# EAGLE design Motherboard (EAGLE 9.4.2)
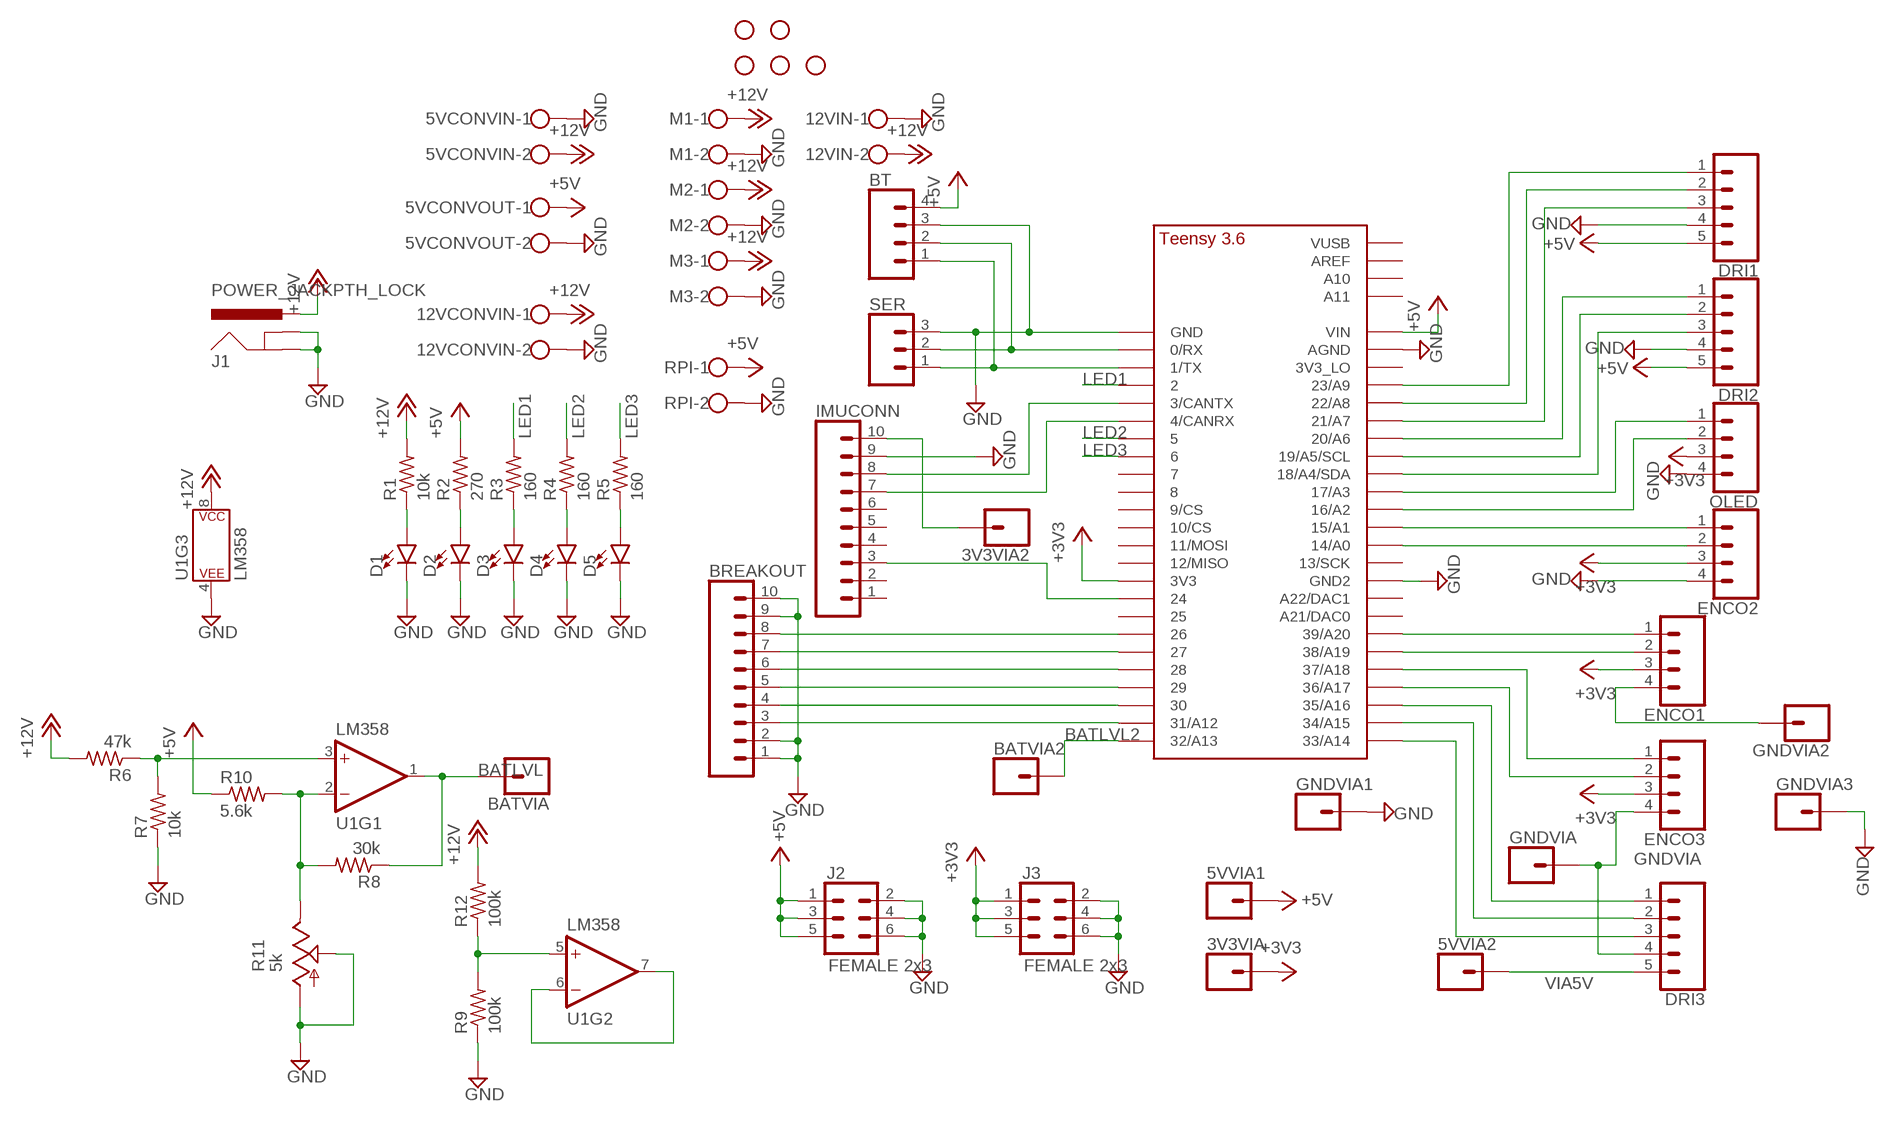
[diagram p0: schematic, sheet 1]

## Parts
3V3VIA  CONN_01  [1X01]
3V3VIA2  CONN_01  [1X01]
5VCONVIN  W237-102  [W237-102]
5VCONVOUT  W237-102  [W237-102]
5VVIA1  CONN_01  [1X01]
5VVIA2  CONN_01  [1X01]
12VCONVIN  W237-102  [W237-102]
12VIN  W237-102  [W237-102]
BATVIA  CONN_01  [1X01]
BATVIA2  CONN_01  [1X01]
BREAKOUT  CONN_10LOCK  [1X10_LOCK]
BT  CONN_04LOCK  [1X04_LOCK]
D1  LED5MM-KIT  [LED_5MM-KIT]
D2  LED5MM-KIT  [LED_5MM-KIT]
D3  LED5MM-KIT  [LED_5MM-KIT]
D4  LED5MM-KIT  [LED_5MM-KIT]
D5  LED5MM-KIT  [LED_5MM-KIT]
DRI1  CONN_05LOCK  [1X05_LOCK]
DRI2  CONN_05LOCK  [1X05_LOCK]
DRI3  CONN_05LOCK  [1X05_LOCK]
ENCO1  CONN_04LOCK  [1X04_LOCK]
ENCO2  CONN_04LOCK  [1X04_LOCK]
ENCO3  CONN_04LOCK  [1X04_LOCK]
GNDVIA  CONN_01  [1X01]
GNDVIA1  CONN_01  [1X01]
GNDVIA2  CONN_01  [1X01]
GNDVIA3  CONN_01  [1X01]
H1  STAND-OFF  [STAND-OFF]
H2  STAND-OFF  [STAND-OFF]
H4  STAND-OFF  [STAND-OFF]
H5  STAND-OFF  [STAND-OFF]
H6  STAND-OFF  [STAND-OFF]
IMUCONN  CONN_10LOCK  [1X10_LOCK]
J1  POWER_JACKPTH_LOCK  [POWER_JACK_PTH_LOCK]
J2  FEMALE 2x3  CONN_03X2FEMALE  [2X3]
J3  FEMALE 2x3  CONN_03X2FEMALE  [2X3]
M1  W237-102  [W237-102]
M2  W237-102  [W237-102]
M3  W237-102  [W237-102]
OLED  CONN_04LOCK  [1X04_LOCK]
R1  10k  R-US_0207/10  [0207/10]
R2  270  R-US_0207/10  [0207/10]
R3  160  R-US_0207/10  [0207/10]
R4  160  R-US_0207/10  [0207/10]
R5  160  R-US_0207/10  [0207/10]
R6  47k  R-US_0207/10  [0207/10]
R7  10k  R-US_0207/10  [0207/10]
R8  30k  R-US_0207/10  [0207/10]
R9  100k  R-US_0207/10  [0207/10]
R10  5.6k  R-US_0207/10  [0207/10]
R11  5k  TRIM_US-B25P  [B25P]
R12  100k  R-US_0207/10  [0207/10]
RPI  W237-102  [W237-102]
SER  CONN_03LOCK  [1X03_LOCK]
U1  LM358  [DIP08]
U$1  TEENSY_3.5/3.6_BASIC  [TEENSY_3.5/3.6_BASIC]

## Nets
+3V3: 3V3VIA.1 ENCO1.3 ENCO2.3 ENCO3.3 J3.1 J3.3 J3.5 OLED.3 U$1.3V3
+5V: 5VCONVOUT.1 5VVIA1.1 BT.4 DRI1.5 DRI2.5 J2.1 J2.3 J2.5 R2.2 R10.1 RPI.1 U$1.VIN
+12V: 5VCONVIN.2 12VCONVIN.1 12VIN.2 J1.PWR M1.1 M2.1 M3.1 R1.2 R6.2 R12.2 U1.8(P$V+)
BATLVL: BATVIA.1 R8.1 U1.1(OUT)
BATLVL2: BATVIA2.1 U$1.32/A13
GND: 5VCONVIN.1 5VCONVOUT.2 12VCONVIN.2 12VIN.1 BREAKOUT.1 BREAKOUT.2 BREAKOUT.9 BREAKOUT.10 BT.3 D1.K(C) D2.K(C) D3.K(C) D4.K(C) D5.K(C) DRI1.4 DRI2.4 ENCO2.4 GNDVIA1.1 GNDVIA3.1 IMUCONN.9 J1.GND J1.GNDBREAK J2.2 J2.4 J2.6 J3.2 J3.4 J3.6 M1.2 M2.2 M3.2 OLED.4 R7.1 R9.1 R11.A R11.S RPI.2 SER.3 U1.4(P$V-) U$1.AGND U$1.GND U$1.GND2
GNDVIA: DRI3.4 ENCO3.4 GNDVIA.1
LED1: R3.2 U$1.2
LED2: R4.2 U$1.5
LED3: R5.2 U$1.6
N$1: DRI1.1 U$1.23/A9
N$2: DRI1.2 U$1.22/A8
N$3: DRI1.3 U$1.21/A7
N$4: DRI2.3 U$1.18/A4/SDA
N$5: DRI2.2 U$1.19/A5/SCL
N$6: DRI2.1 U$1.20/A6
N$7: ENCO2.1 U$1.15/A1
N$8: ENCO2.2 U$1.14/A0
N$9: ENCO1.1 U$1.39/A20
N$10: ENCO1.2 U$1.38/A19
N$11: ENCO3.1 U$1.37/A18
N$12: ENCO3.2 U$1.36/A17
N$13: DRI3.1 U$1.35/A16
N$14: DRI3.2 U$1.34/A15
N$15: DRI3.3 U$1.33/A14
N$16: BT.1 SER.1 U$1.1/TX
N$17: BT.2 SER.2 U$1.0/RX
N$18: IMUCONN.8 U$1.3/CANTX
N$19: IMUCONN.7 U$1.4/CANRX
N$20: IMUCONN.3 U$1.24
N$21: R9.2 R12.1 U1.5(+IN)
N$22: BREAKOUT.3 U$1.31/A12
N$23: BREAKOUT.4 U$1.30
N$24: BREAKOUT.5 U$1.29
N$25: BREAKOUT.6 U$1.28
N$26: BREAKOUT.7 U$1.27
N$27: BREAKOUT.8 U$1.26
N$28: D2.A R2.1
N$29: D1.A R1.1
N$30: D3.A R3.1
N$31: D5.A R5.1
N$32: D4.A R4.1
N$33: 3V3VIA2.1 IMUCONN.10
N$34: OLED.1 U$1.17/A3
N$35: OLED.2 U$1.16/A2
N$36: R6.1 R7.2 U1.3(+IN)
N$37: U1.6(-IN) U1.7(OUT)
N$38: R8.2 R10.2 R11.E U1.2(-IN)
N$39: ENCO1.4 GNDVIA2.1
VIA5V: 5VVIA2.1 DRI3.5
Unconnected: IMUCONN.1 IMUCONN.2 IMUCONN.4 IMUCONN.5 IMUCONN.6 U$1.3V3_LO U$1.7 U$1.8 U$1.9/CS U$1.10/CS U$1.11/MOSI U$1.12/MISO U$1.13/SCK U$1.21/DAC0(A21/DAC0) U$1.25 U$1.A10 U$1.A11 U$1.A22/DAC1 U$1.AREF U$1.VUSB

## Library data of the parts
3V3VIA 3V3VIA2 5VVIA1 5VVIA2 BATVIA BATVIA2 GNDVIA GNDVIA1-GNDVIA3 = SparkFun-Connectors:CONN_01: Single connection point. Often used as Generic Header-pin footprint for 0.1 inch spaced/style header connections On any of the 0.1 inch spaced packages, you can populate with these: Break Away Headers - Straight <https://www.sparkfun.com/products/116> (PRT-00116) Break Away Male Headers - Right Angle <https://www.sparkfun.com/products/553> (PRT-00553) Female Headers <https://www.sparkfun.com/products/115> (PRT-00115) Break Away Headers - Machine Pin <https://www.sparkfun.com/products/117> (PRT-00117) Break Away Female Headers - Swiss Machine Pin <https://www.sparkfun.com/products/743> (PRT-00743) This device is also useful as a general connection point to wire up your design to another part of your project. Our various solder wires solder well into these plated through hole pads. Hook-Up Wire - Assortment (Stranded, 22 AWG) <https://www.sparkfun.com/products/11375> (PRT-11375) Hook-Up Wire - Assortment (Solid Core, 22 AWG) <https://www.sparkfun.com/products/11367> (PRT-11367) View the entire wire category on our website here <https://www.sparkfun.com/categories/141> Special notes: SMTSO-256-ET is a "flush mount" nut for a 4-40 screw. We mostly use this on specialty testbeds; it is a nice way to connect hardware to your PCB at an adjustable hieght. Also note, the SNAP packages are for using a snappable style connector. We sell a baggie of snaps and they are also used on two LilyPad designs: Snap Assortment - 30 pack (male and female) <https://www.sparkfun.com/products/11347> (DEV-11347) LilyPad Arduino SimpleSnap <https://www.sparkfun.com/products/10941> (DEV-10941) LilyPad SimpleSnap Protoboard <https://www.sparkfun.com/products/10940> (DEV-10940)
5VCONVIN 5VCONVOUT 12VCONVIN 12VIN M1-M3 RPI = con-wago-500:W237-102: WAGO SCREW CLAMP; MPN: 237-102; OC_FARNELL: unknown; OC_NEWARK: 70K9898
BREAKOUT IMUCONN = SparkFun-Connectors:CONN_10: Multi connection point. Often used as Generic Header-pin footprint for 0.1 inch spaced/style header connections On any of the 0.1 inch spaced packages, you can populate with these: Break Away Headers - Straight <https://www.sparkfun.com/products/116> (PRT-00116) Break Away Male Headers - Right Angle <https://www.sparkfun.com/products/553> (PRT-00553) Female Headers <https://www.sparkfun.com/products/115> (PRT-00115) Break Away Headers - Machine Pin <https://www.sparkfun.com/products/117> (PRT-00117) Break Away Female Headers - Swiss Machine Pin <https://www.sparkfun.com/products/743> (PRT-00743) Arduino Stackable Header - 10 Pin <https://www.sparkfun.com/products/11376> (PRT-11376) For SCREWTERMINALS and SPRING TERMINALS visit here: Screw Terimnals on SparkFun.com <https://www.sparkfun.com/search/results?term=Screw+Terminals> (5mm/3.5mm/2.54mm spacing) This device is also useful as a general connection point to wire up your design to another part of your project. Our various solder wires solder well into these plated through hole pads. Hook-Up Wire - Assortment (Stranded, 22 AWG) <https://www.sparkfun.com/products/11375> (PRT-11375) Hook-Up Wire - Assortment (Solid Core, 22 AWG) <https://www.sparkfun.com/products/11367> (PRT-11367) View the entire wire category on our website here <https://www.sparkfun.com/categories/141> Special notes: Molex polarized connector foot print use with SKU : PRT-08231 with associated crimp pins and housings. 1MM SMD Version SKU: PRT-10208 NOTES ON THE VARIANTS LOCK and LOCK_LONGPADS... This footprint was designed to help hold the alignment of a through-hole component (i.e. 6-pin header) while soldering it into place. You may notice that each hole has been shifted either up or down by 0.005 of an inch from it's more standard position (which is a perfectly straight line). This slight alteration caused the pins (the squares in the middle) to touch the edges of the holes. Because they are alternating, it causes a "brace" to hold the component in place. 0.005 has proven to be the perfect amount of "off-center" position when using our standard breakaway headers. Although looks a little odd when you look at the bare footprint, once you have a header in there, the alteration is very hard to notice. Also,if you push a header all the way into place, it is covered up entirely on the bottom side.
BT ENCO1-ENCO3 OLED = SparkFun-Connectors:CONN_04: Multi connection point. Often used as Generic Header-pin footprint for 0.1 inch spaced/style header connections On any of the 0.1 inch spaced packages, you can populate with these: Break Away Headers - Straight <https://www.sparkfun.com/products/116> (PRT-00116) Break Away Male Headers - Right Angle <https://www.sparkfun.com/products/553> (PRT-00553) Female Headers <https://www.sparkfun.com/products/115> (PRT-00115) Break Away Headers - Machine Pin <https://www.sparkfun.com/products/117> (PRT-00117) Break Away Female Headers - Swiss Machine Pin <https://www.sparkfun.com/products/743> (PRT-00743) For SCREWTERMINALS and SPRING TERMINALS visit here: Screw Terimnals on SparkFun.com <https://www.sparkfun.com/search/results?term=Screw+Terminals> (5mm/3.5mm/2.54mm spacing) This device is also useful as a general connection point to wire up your design to another part of your project. Our various solder wires solder well into these plated through hole pads. Hook-Up Wire - Assortment (Stranded, 22 AWG) <https://www.sparkfun.com/products/11375> (PRT-11375) Hook-Up Wire - Assortment (Solid Core, 22 AWG) <https://www.sparkfun.com/products/11367> (PRT-11367) View the entire wire category on our website here <https://www.sparkfun.com/categories/141> Special notes: Molex polarized connector foot print use with SKU : PRT-08231 with associated crimp pins and housings. 1MM SMD Version SKU: PRT-10208; PROD_ID: CONN-09696
D1-D5 = SparkFun-LED:LED: LED (Generic) Standard schematic elements and footprints for 5mm, 3mm, 1206, and 0603 sized LEDs. Generic LEDs with no color specified.
DRI1-DRI3 = SparkFun-Connectors:CONN_05: Multi connection point. Often used as Generic Header-pin footprint for 0.1 inch spaced/style header connections On any of the 0.1 inch spaced packages, you can populate with these: Break Away Headers - Straight <https://www.sparkfun.com/products/116> (PRT-00116) Break Away Male Headers - Right Angle <https://www.sparkfun.com/products/553> (PRT-00553) Female Headers <https://www.sparkfun.com/products/115> (PRT-00115) Break Away Headers - Machine Pin <https://www.sparkfun.com/products/117> (PRT-00117) Break Away Female Headers - Swiss Machine Pin <https://www.sparkfun.com/products/743> (PRT-00743) For SCREWTERMINALS and SPRING TERMINALS visit here: Screw Terimnals on SparkFun.com <https://www.sparkfun.com/search/results?term=Screw+Terminals> (5mm/3.5mm/2.54mm spacing) This device is also useful as a general connection point to wire up your design to another part of your project. Our various solder wires solder well into these plated through hole pads. Hook-Up Wire - Assortment (Stranded, 22 AWG) <https://www.sparkfun.com/products/11375> (PRT-11375) Hook-Up Wire - Assortment (Solid Core, 22 AWG) <https://www.sparkfun.com/products/11367> (PRT-11367) View the entire wire category on our website here <https://www.sparkfun.com/categories/141> Special notes: Molex polarized connector foot print use with SKU : PRT-08231 with associated crimp pins and housings. 1MM SMD Version SKU: PRT-10208
H1 H2 H4-H6 = SparkFun-Hardware:STAND-OFF: Stand Off Drill holes for mechanically mounting via screws, standoffs, etc. Note: Use the keepout ring to avoid running the screw head into surrounding components. Variant Overviews STAND-OFF - Mechanical footprint for a #4 phillips button head screw. STAND-OFF-TIGHT - Mechanical footprint for a #4 phillips button head screw, Example SparkFun Products Screw - Phillips Head (1/4", 4-40, 10 pack) <https://www.sparkfun.com/products/10453> (PRT-10453) Screw - Phillips Head (1/2", 4-40, 10 pack) <https://www.sparkfun.com/products/10452> (PRT-10452) Screw - Phillips Head (3/4", 4-40, 10 pack) <https://www.sparkfun.com/products/10451> (PRT-10451) Screw - Phillips Head (1", 4-40, 10 pack) <https://www.sparkfun.com/products/10450> (PRT-10450)
J1 = SparkFun-Connectors:POWER_JACK: Power Jack Connector This is the standard 5.5mm barrel jack for power. The PTH is the most common, proven, reliable, footprint. The Slot footprint only works if the mill layer is transmitted to the PCB fab house so be warned. Here are the connectors we sell at SparkFun: DC Barrel Power Jack/Connector <https://www.sparkfun.com/products/119> (PRT-00119) DC Barrel Power Jack/Connector (SMD) <https://www.sparkfun.com/products/12748> (PRT-12748) DC Barrel Jack Adapter - Breadboard Compatible <https://www.sparkfun.com/products/10811> (PRT-10811) It is used on this SparkFun product (and many, many others): SparkFun RedBoard - Programmed with Arduino <https://www.sparkfun.com/products/12757> (DEV-12757) Also, if you need a mating power supply or connector, please check these out: Wall Adapter Power Supply - 9VDC 650mA <https://www.sparkfun.com/products/298> (TOL-00298) DC Barrel Jack Adapter - Male <https://www.sparkfun.com/products/10287> (PRT-10287); PROD_ID: CONN-08197; SF_ID: PRT-00119
J2 J3 = SparkFun-Connectors:CONN_03X2: Multi connection point. Often used as Generic Header-pin footprint for 0.1 inch spaced/style header connections You can populate with any combo of single row headers, but if you'd like an exact match, check these: Header - 2x3 (Male, 0.1") <https://www.sparkfun.com/products/12807> (PRT-12807) Header - 2x3 (Female, 0.1") <https://www.sparkfun.com/products/13010> (PRT-13010) 2x3 Pin Shrouded Header <https://www.sparkfun.com/products/10877> (PRT-10877) On any of the 0.1 inch spaced packages, you can populate with these: Break Away Headers - Straight <https://www.sparkfun.com/products/116> (PRT-00116) Break Away Male Headers - Right Angle <https://www.sparkfun.com/products/553> (PRT-00553) Female Headers <https://www.sparkfun.com/products/115> (PRT-00115) Break Away Headers - Machine Pin <https://www.sparkfun.com/products/117> (PRT-00117) Break Away Female Headers - Swiss Machine Pin <https://www.sparkfun.com/products/743> (PRT-00743) Special note: the shrouded connector mates well with our 3x2 ribbon cables: Ribbon Crimp Connector - 6-pin (2x3, Female) <https://www.sparkfun.com/products/10651> (PRT-10651) Ribbon Cable - 6 wire (15ft) <https://www.sparkfun.com/products/10646> (PRT-10646); PROD_ID: CONN-11566
R1-R10 R12 = rcl:R-US_: RESISTOR, American symbol; SPICEPREFIX: R
R11 = pot:TRIM_US-: POTENTIOMETER
SER = SparkFun-Connectors:CONN_03: Multi connection point. Often used as Generic Header-pin footprint for 0.1 inch spaced/style header connections On any of the 0.1 inch spaced packages, you can populate with these: Break Away Headers - Straight <https://www.sparkfun.com/products/116> (PRT-00116) Break Away Male Headers - Right Angle <https://www.sparkfun.com/products/553> (PRT-00553) Female Headers <https://www.sparkfun.com/products/115> (PRT-00115) Break Away Headers - Machine Pin <https://www.sparkfun.com/products/117> (PRT-00117) Break Away Female Headers - Swiss Machine Pin <https://www.sparkfun.com/products/743> (PRT-00743) Stackable Header - 3 Pin (Female, 0.1") <https://www.sparkfun.com/products/13875> (PRT-13875) For SCREWTERMINALS and SPRING TERMINALS visit here: Screw Terimnals on SparkFun.com <https://www.sparkfun.com/search/results?term=Screw+Terminals> (5mm/3.5mm/2.54mm spacing) This device is also useful as a general connection point to wire up your design to another part of your project. Our various solder wires solder well into these plated through hole pads. Hook-Up Wire - Assortment (Stranded, 22 AWG) <https://www.sparkfun.com/products/11375> (PRT-11375) Hook-Up Wire - Assortment (Solid Core, 22 AWG) <https://www.sparkfun.com/products/11367> (PRT-11367) View the entire wire category on our website here <https://www.sparkfun.com/categories/141> Special notes: Molex polarized connector foot print use with SKU : PRT-08232 with associated crimp pins and housings.
U1 = SparkFun-IC-Amplifiers:LM358: LM358 Jellybean op-amp Datasheet <http://www.sparkfun.com/datasheets/Components/General/LM358.pdf> SparkFun Products Op-Amp (Thru-Hole) - LM358 <https://www.sparkfun.com/products/9456> (COM-09456); PROD_ID: IC-09172
U$1 = Teensy356:TEENSY_3.5/3.6_BASIC

## Board
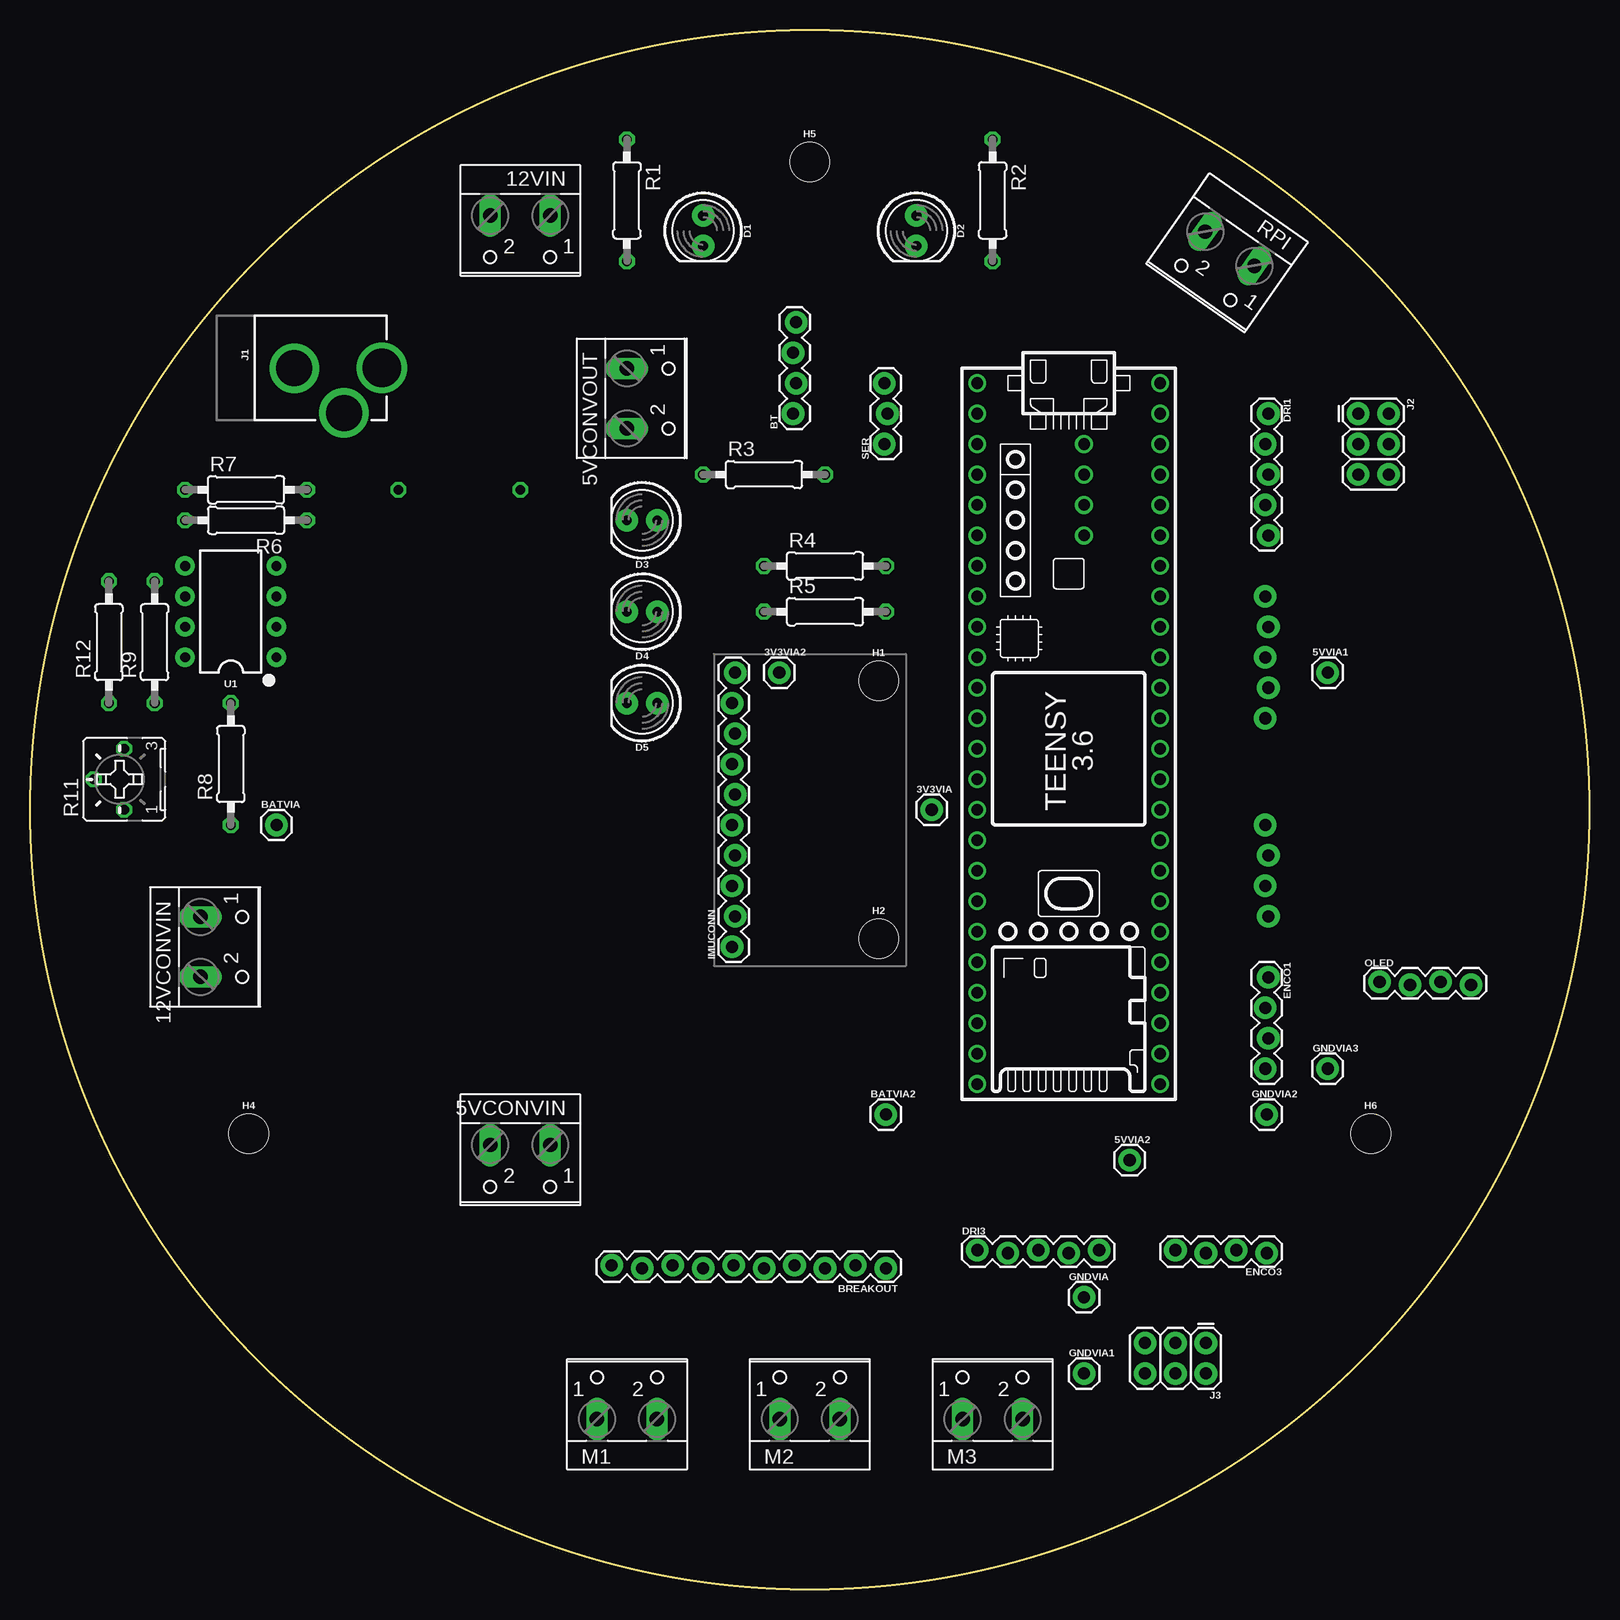
[diagram p1: board, top side]
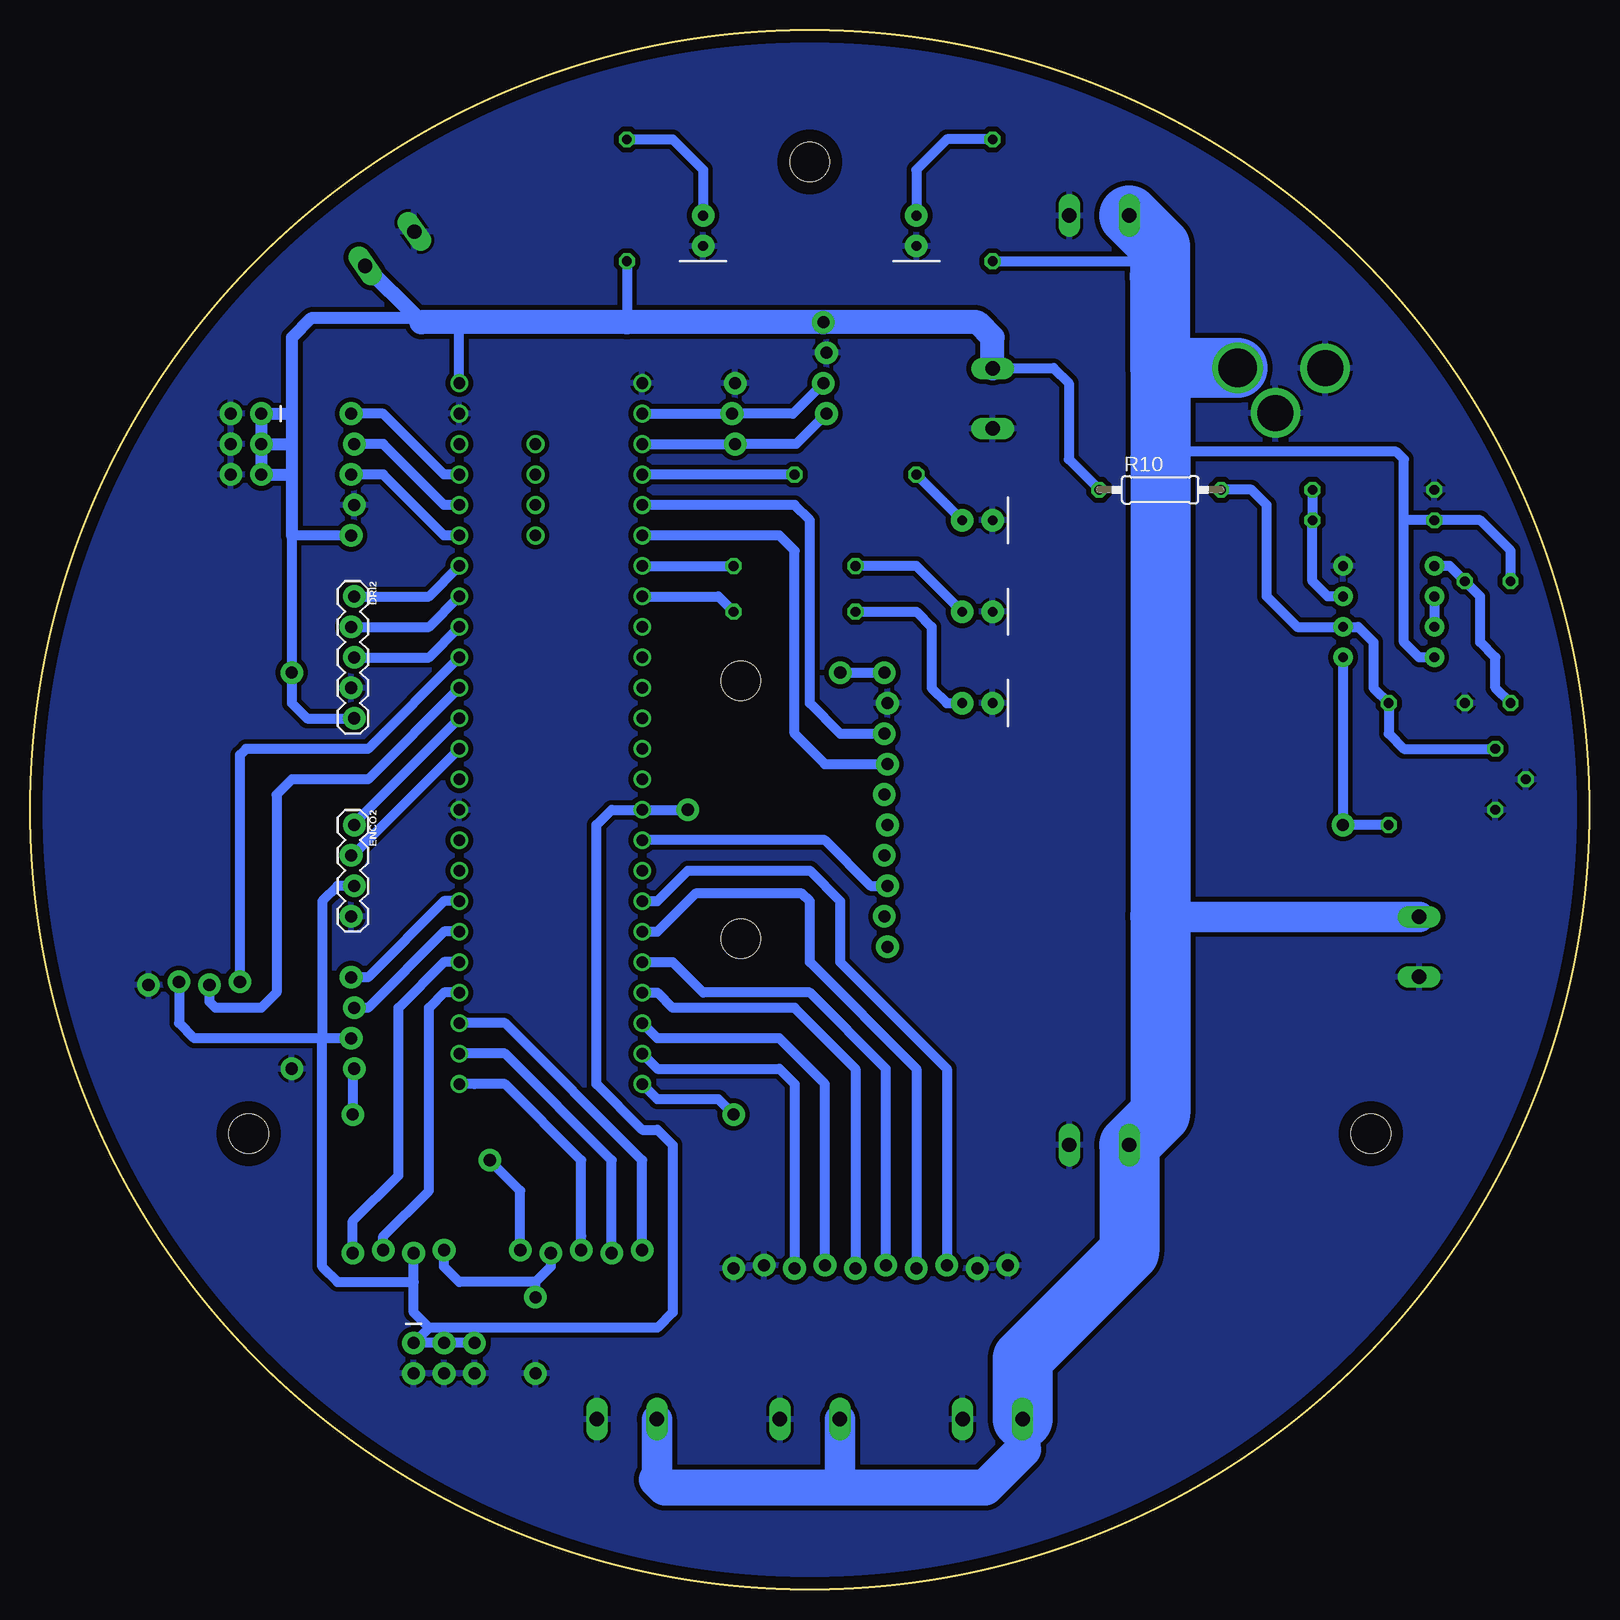
[diagram p2: board, bottom side, seen from below]

Size 130 x 130 mm. Coordinates in mm from the lower left corner, seen from the top.
Outline: circle at 65,65 radius 65
Copper layers (1*16): Top 0.035mm / dielectric 1.5mm / Bottom 0.035mm
Design rules "default": minimum track width 6mil, minimum drill 0.35mm, track to track 6mil, track to pad 6mil, pad to pad 6mil, via to via 6mil, smd to smd 6mil, copper to edge 40mil, drill to drill 6mil, minimum pad ring 10mil, minimum via ring 8mil, stop-mask expansion 4mil, vias tented up to drill 0mil, thermal gap 10mil

### Footprints (pad centres in the part's own frame; a part is rotated, then mirrored left to right if it is on the bottom)
1X01 = drill 1.016 pad 1.88: 1 0,0
W237-102 = drill 1.194 long: 1 -2.5,-1.27; 2 2.5,-1.27
1X10_LOCK = drill 1.016 pad 1.88: 1 0,0.127; 2 2.54,-0.127; 3 5.08,0.127; 4 7.62,-0.127; 5 10.16,0.127; 6 12.7,-0.127; 7 15.24,0.127; 8 17.78,-0.127; 9 20.32,0.127; 10 22.86,-0.127
1X04_LOCK = drill 1.016 pad 1.88: 1 0,0.127; 2 2.54,-0.127; 3 5.08,0.127; 4 7.62,-0.127
LED_5MM-KIT = drill 0.813 pad 1.88: A -1.27,0; K 1.27,0
1X05_LOCK = drill 1.016 pad 1.88: 1 0,0.127; 2 2.54,-0.127; 3 5.08,0.127; 4 7.62,-0.127; 5 10.16,0.127
STAND-OFF = hole 3.302: 0,0
POWER_JACK_PTH_LOCK = drill 2.997 pad 4.115: GND 0.025,6.557; GNDBREAK 3.762,10.7 | drill 3.2 pad 4.115: PWR 0,13.878
2X3 = drill 1.016 pad 1.88: 1 0,0; 2 0,2.54; 3 2.54,0; 4 2.54,2.54; 5 5.08,0; 6 5.08,2.54
0207/10 = drill 0.813 octagon: 1 -5.08,0; 2 5.08,0
B25P = drill 0.813 octagon: A -2.54,0; E 2.54,0; S 0,2.54
1X03_LOCK = drill 1.016 pad 1.88: 1 0,0.127; 2 2.54,-0.127; 3 5.08,0.127
DIP08 = drill 0.813 pad 1.626: 1 -3.81,-3.81; 2 -1.27,-3.81; 3 1.27,-3.81; 4 3.81,-3.81; 5 3.81,3.81; 6 1.27,3.81; 7 -1.27,3.81; 8 -3.81,3.81
TEENSY_3.5/3.6_BASIC = drill 0.965: 0/RX -25.4,-7.62; 1/TX -22.86,-7.62; 2 -20.32,-7.62; 3/CANTX -17.78,-7.62; 3V3 7.62,-7.62; 3V3_LO -22.86,7.62; 4/CANRX -15.24,-7.62; 5 -12.7,-7.62; 6 -10.16,-7.62; 7 -7.62,-7.62; 8 -5.08,-7.62; 9/CS -2.54,-7.62; 10/CS 0,-7.62; 11/MOSI 2.54,-7.62; 12/MISO 5.08,-7.62; 13/SCK 5.08,7.62; 14/A0 2.54,7.62; 15/A1 0,7.62; 16/A2 -2.54,7.62; 17/A3 -5.08,7.62; 18/A4/SDA -7.62,7.62; 19/A5/SCL -10.16,7.62; 20/A6 -12.7,7.62; 21/A7 -15.24,7.62; 21/DAC0 12.7,7.62; 22/A8 -17.78,7.62; 23/A9 -20.32,7.62; 24 10.16,-7.62; 25 12.7,-7.62; 26 15.24,-7.62; 27 17.78,-7.62; 28 20.32,-7.62; 29 22.86,-7.62; 30 25.4,-7.62; 31/A12 27.94,-7.62; 32/A13 30.48,-7.62; 33/A14 30.48,7.62; 34/A15 27.94,7.62; 35/A16 25.4,7.62; 36/A17 22.86,7.62; 37/A18 20.32,7.62; 38/A19 17.78,7.62; 39/A20 15.24,7.62; A10 -17.78,1.27; A11 -15.24,1.27; A22/DAC1 10.16,7.62; AGND -25.4,7.62; AREF -20.32,1.27; GND -27.94,-7.62; GND2 7.62,7.62; VIN -27.94,7.62; VUSB -22.86,1.27

### Placement (x,y rotation side)
3V3VIA  75.16,65 0 top
3V3VIA2  62.46,76.43 0 top
5VCONVIN  40.87,35.79 180 top
5VCONVOUT  51.03,99.29 270 top
5VVIA1  108.18,76.43 0 top
5VVIA2  91.67,35.79 0 top
12VCONVIN  15.47,53.57 270 top
12VIN  40.87,113.26 180 top
BATVIA  20.55,63.73 0 top
BATVIA2  71.35,39.6 0 top
BREAKOUT  71.35,26.9 180 top
BT  63.73,98.02 90 top
D1  56.11,113.26 270 top
D2  73.89,113.26 270 top
D3  51.03,89.13 180 top
D4  51.03,81.51 180 top
D5  51.03,73.89 180 top
DRI1  103.1,98.02 270 top
DRI2  103.1,82.78 270 bottom
DRI3  78.97,28.17 0 top
ENCO1  103.1,51.03 270 top
ENCO2  103.1,63.73 270 bottom
ENCO3  103.1,28.17 180 top
GNDVIA  87.86,24.36 0 top
GNDVIA1  87.86,18.01 0 top
GNDVIA2  103.1,39.6 0 top
GNDVIA3  108.18,43.41 0 top
H1  70.75,75.75 0 top
H2  70.75,54.25 0 top
H4  18.23,38 0 top
H5  65,119 0 top
H6  111.77,38 0 top
IMUCONN  58.65,53.57 90 top
J1  15.47,101.83 270 top
J2  110.72,98.02 270 top
J3  98.02,20.55 180 top
M1  49.76,15.47 0 top
M2  65,15.47 0 top
M3  80.24,15.47 0 top
OLED  112.5,50.52 0 top
R1  49.76,115.8 270 top
R2  80.24,115.8 270 top
R3  61.19,92.94 0 top
R4  66.27,85.32 0 top
R5  66.27,81.51 0 top
R6  18.01,89.13 180 top
R7  18.01,91.67 0 top
R8  16.74,68.81 90 top
R9  10.39,78.97 90 top
R10  35.79,91.67 0 bottom
R11  7.85,67.54 90 top
R12  6.58,78.97 90 top
RPI  99.29,110.72 145 top
SER  71.35,95.48 90 top
U1  16.74,81.51 90 top
U$1  86.59,72.62 270 top

### Tracks (layer width: path | path; a pad name or v marks a point on that pad's centre or on a via)
+3V3
  Bottom 0.813: ENCO2.3 104.37,58.65 105.64,57.38 105.64,45.95 | 3V3VIA.1 U$1.3V3 81.51,65 82.78,63.73 82.78,42.14 78.97,38.33 77.7,38.33 76.43,37.06 76.43,23.09 77.7,21.82 92.94,21.82 | 105.64,45.95 105.64,26.9 104.37,25.63 98.02,25.63 | OLED.3 117.58,47.22 116.31,45.95 105.64,45.95 | ENCO1.3 105.64,45.95 | 92.94,21.82 95.48,21.82 | 95.48,21.82 96.75,21.82 | 96.75,21.82 98.02,23.09 98.02,25.63 | 98.02,25.63 ENCO3.3 | 92.94,21.82 J3.5 J3.3 | J3.3 95.48,21.82 | 96.75,21.82 J3.1 J3.3
+5V
  Bottom 0.813: DRI1.5 108.18,87.86 5VVIA1.1 108.18,73.89 106.91,72.62 DRI2.5 | R2.2 80.24,105.64 | U$1.VIN 94.21,105.64 | R10.1 43.41,94.21 43.41,100.56 44.68,101.83 49.72,101.83 5VCONVOUT.1
  Bottom 1.016: 97.7,105.96 106.59,105.96 108.18,104.37 108.18,98.02 | 108.18,98.02 108.18,95.48 | 108.18,95.48 108.18,92.94 | 108.18,92.94 108.18,87.86 | 108.18,98.02 J2.1 J2.3 | J2.3 J2.5 108.18,92.94 | J2.3 108.18,95.48
  Bottom 1.27: 97.38,105.64 97.7,105.96 RPI.1
  Bottom 2: 5VCONVOUT.1 49.76,104.37 51.03,105.64 BT.4 80.24,105.64 94.21,105.64 97.38,105.64
+12V
  Bottom 0.813: 35.83,109.45 37.1,110.72 R1.2 | 15.47,89.13 R6.2 9.12,89.13 6.58,86.59 R12.2 | 15.47,89.13 15.47,94.21 16.1,94.84 35.16,94.84 35.79,94.21 | U1.8 14.2,77.7 15.47,78.97 15.47,89.13
  Bottom 2: 35.75,56.07 35.79,56.11
  Bottom 2.54: M2.1 62.5,8.52 | M3.1 77.74,9.16 | 12VCONVIN.1 35.75,56.07
  Bottom 3: 62.46,8.48 77.06,8.48 77.74,9.16 | 62.5,8.52 62.46,8.48 | 62.46,8.48 50.39,8.48 47.22,11.66 47.26,11.7 M1.1
  Bottom 5: 35.83,109.45 35.79,109.45 | 35.79,101.83 35.79,109.45 | 35.79,101.83 35.79,94.21 35.79,56.11 35.79,39.64 5VCONVIN.2 38.37,28.13 47.26,19.24 M1.1 | J1.PWR 35.79,101.83 | 35.79,109.45 35.79,111.95 12VIN.2
BATLVL
  Bottom 0.813: U1.1 BATVIA.1 R8.1
BATLVL2
  Bottom 0.813: U$1.32/A13 77.7,40.87 72.62,40.87 BATVIA2.1
GND
  pour Bottom (isolate 0.406): 1.5,133.58 -2.31,133.58 -2.31,-1.04 131.04,-1.04 131.04,131.04 4.04,131.04
GNDVIA
  Bottom 0.813: DRI3.4 86.59,26.9 87.86,25.63 | 87.86,25.63 94.21,25.63 95.48,26.9 ENCO3.4 | GNDVIA.1 87.86,25.63
LED1
  Bottom 0.813: R3.2 U$1.2
LED2
  Bottom 0.813: U$1.5 R4.2
LED3
  Bottom 0.813: U$1.6 72.62,82.78 R5.2
N$1
  Bottom 0.813: U$1.23/A9 95.48,92.94 100.56,98.02 DRI1.1
N$2
  Bottom 0.813: U$1.22/A8 95.48,90.4 100.56,95.48 DRI1.2
N$3
  Bottom 0.813: U$1.21/A7 95.48,87.86 100.56,92.94 DRI1.3
N$4
  Bottom 0.813: U$1.18/A4/SDA 96.75,77.7 DRI2.3
N$5
  Bottom 0.813: U$1.19/A5/SCL 96.75,80.24 DRI2.2
N$6
  Bottom 0.813: U$1.20/A6 96.75,82.78 DRI2.1
N$7
  Bottom 0.813: ENCO2.1 102.97,63.86 U$1.15/A1
N$8
  Bottom 0.813: ENCO2.2 103.1,61.19 U$1.14/A0
N$9
  Bottom 0.813: U$1.39/A20 95.48,57.38 101.83,51.03 ENCO1.1
N$10
  Bottom 0.813: U$1.38/A19 95.48,54.84 101.83,48.49 ENCO1.2
N$11
  Bottom 0.813: U$1.37/A18 95.48,52.3 99.29,48.49 99.29,34.52 103.1,30.71 ENCO3.1
N$12
  Bottom 0.813: U$1.36/A17 95.48,49.76 96.75,48.49 96.75,33.25 100.56,29.44 ENCO3.2
N$13
  Bottom 0.813: U$1.35/A16 90.4,47.22 78.97,35.79 DRI3.1
N$14
  Bottom 0.813: U$1.34/A15 90.4,44.68 81.51,35.79 DRI3.2
N$15
  Bottom 0.813: U$1.33/A14 92.94,42.14 90.4,42.14 84.05,35.79 84.05,29.44 DRI3.3
N$16
  Bottom 0.813: U$1.1/TX SER.1 66.14,95.48 BT.1
N$17
  Bottom 0.813: U$1.0/RX SER.2 66.4,98.02 BT.2
N$18
  Bottom 0.813: IMUCONN.8 62.46,71.35 65,73.89 65,89.13 66.27,90.4 U$1.3/CANTX
N$19
  Bottom 0.813: IMUCONN.7 63.73,68.81 66.27,71.35 66.27,86.59 67.54,87.86 U$1.4/CANRX
N$20
  Bottom 0.813: U$1.24 63.73,62.46 59.92,58.65 IMUCONN.3
N$21
  Bottom 0.813: U1.5 11.66,85.32 R9.2 9.12,82.78 9.12,78.97 7.85,77.7 7.85,75.16 R12.1
N$22
  Bottom 0.813: U$1.31/A12 77.7,43.41 67.54,43.41 66.27,42.14 BREAKOUT.3
N$23
  Bottom 0.813: U$1.30 77.7,45.95 67.54,45.95 63.73,42.14 BREAKOUT.4
N$24
  Bottom 0.813: U$1.29 77.7,49.76 76.43,48.49 66.27,48.49 61.19,43.41 BREAKOUT.5
N$25
  Bottom 0.813: U$1.28 76.43,52.3 73.89,49.76 65,49.76 58.65,43.41 BREAKOUT.6
N$26
  Bottom 0.813: U$1.27 77.7,54.84 74.53,58.02 65.64,58.02 65,57.38 65,52.3 56.11,43.41 BREAKOUT.7
N$27
  Bottom 0.813: U$1.26 77.7,57.38 75.16,59.92 65,59.92 62.46,57.38 62.46,52.3 53.57,43.41 BREAKOUT.8
N$28
  Bottom 0.813: R2.1 76.43,120.88 73.89,118.34 D2.A
N$29
  Bottom 0.813: R1.1 53.57,120.88 56.11,118.34 D1.A
N$30
  Bottom 0.813: D3.A R3.1
N$31
  Bottom 0.813: R5.1 56.11,81.51 54.84,80.24 54.84,75.16 53.57,73.89 D5.A
N$32
  Bottom 0.813: D4.A 56.11,85.32 R4.1
N$33
  Bottom 0.813: 3V3VIA2.1 IMUCONN.10
N$34
  Bottom 0.813: OLED.1 112.5,69.57 111.99,70.08 101.83,70.08 U$1.17/A3
N$35
  Bottom 0.813: OLED.2 115.04,49 114.53,48.49 110.72,48.49 109.45,49.76 109.45,66.27 108.18,67.54 101.83,67.54 U$1.16/A2
N$36
  Bottom 0.813: R7.2 R6.1 23.09,84.05 21.82,82.78 U1.3
N$37
  Bottom 0.813: U1.6 U1.7
N$38
  Bottom 0.813: R10.2 28.17,91.67 26.9,90.4 26.9,82.78 24.36,80.24 U1.2 19.28,80.24 18.01,78.97 18.01,75.16 R8.2 16.74,71.35 15.47,70.08 R11.E
N$39
  Bottom 0.813: ENCO1.4 103.1,43.28 GNDVIA2.1
VIA5V
  Bottom 0.813: DRI3.5 89.13,33.25 5VVIA2.1